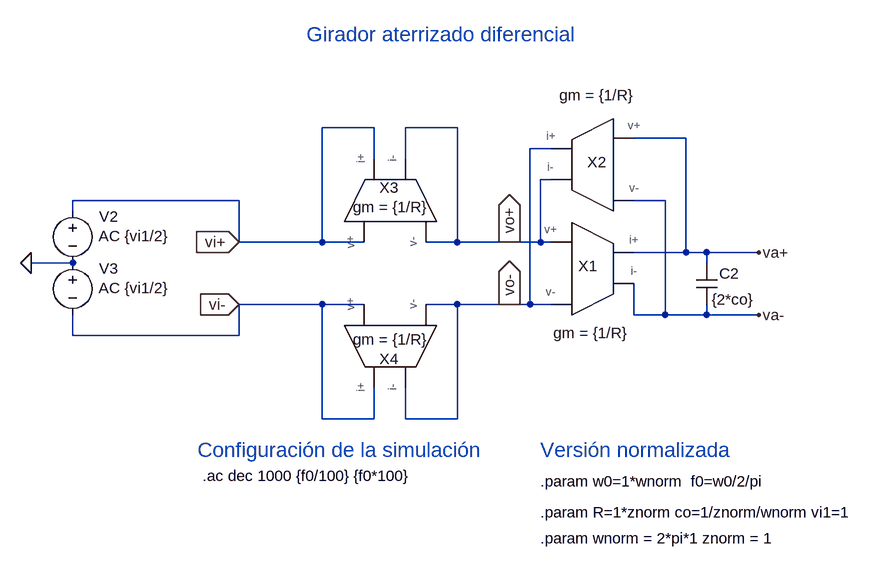
[diagram p0: schematic OTA girador aterrizado diferencial.asc]
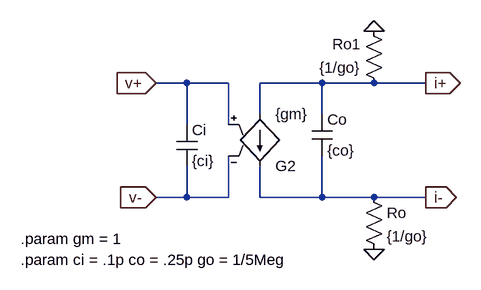
[diagram p1: sub-circuit ota_diff.asc]
OTA girador aterrizado diferencial.asc, the LTspice schematic file:
Version 4
SHEET 1 1244 880
WIRE 272 -96 192 -96
WIRE 400 -96 320 -96
WIRE 752 -80 672 -80
WIRE 544 -64 512 -64
WIRE 272 -48 272 -96
WIRE 320 -48 320 -96
WIRE 544 -16 528 -16
WIRE 64 16 -192 16
WIRE 720 16 672 16
WIRE -192 32 -192 16
WIRE 64 80 64 16
WIRE 192 80 192 -96
WIRE 192 80 64 80
WIRE 256 80 192 80
WIRE 400 80 400 -96
WIRE 400 80 352 80
WIRE 480 80 400 80
WIRE 528 80 528 -16
WIRE 528 80 480 80
WIRE 544 80 528 80
WIRE 752 96 752 -80
WIRE 752 96 672 96
WIRE 784 96 752 96
WIRE 864 96 784 96
WIRE -192 112 -256 112
WIRE 784 112 784 96
WIRE 192 176 64 176
WIRE 256 176 192 176
WIRE 400 176 352 176
WIRE 480 176 400 176
WIRE 512 176 512 -64
WIRE 512 176 480 176
WIRE 544 176 512 176
WIRE 672 192 672 144
WIRE 720 192 720 16
WIRE 720 192 672 192
WIRE 784 192 784 176
WIRE 784 192 720 192
WIRE 864 192 784 192
WIRE -192 224 -192 192
WIRE 64 224 64 176
WIRE 64 224 -192 224
WIRE 192 352 192 176
WIRE 272 352 272 304
WIRE 272 352 192 352
WIRE 320 352 320 304
WIRE 400 352 400 176
WIRE 400 352 320 352
FLAG 64 80 vi+
IOPIN 64 80 In
FLAG 480 80 vo+
IOPIN 480 80 Out
FLAG 64 176 vi-
IOPIN 64 176 In
FLAG -256 112 0
FLAG 480 176 vo-
IOPIN 480 176 Out
FLAG 864 96 va+
FLAG 864 192 va-
SYMBOL voltage -192 16 R0
WINDOW 123 40 55 Left 2
WINDOW 39 0 0 Left 0
WINDOW 0 41 25 Left 2
SYMATTR Value2 AC {vi1/2}
SYMATTR InstName V2
SYMATTR Value ""
SYMBOL voltage -192 96 R0
WINDOW 123 40 55 Left 2
WINDOW 39 0 0 Left 0
WINDOW 0 41 25 Left 2
SYMATTR Value2 AC {vi1/2}
SYMATTR InstName V3
SYMATTR Value ""
SYMBOL OTA_diff 624 128 R0
WINDOW 0 -23 -27 Top 2
WINDOW 39 -18 76 Top 2
SYMATTR InstName X1
SYMATTR SpiceLine gm = {1/R}
SYMBOL OTA_diff 592 -32 M0
WINDOW 0 -23 -27 Top 2
WINDOW 39 -23 -130 Top 2
SYMATTR InstName X2
SYMATTR SpiceLine gm = {1/R}
SYMBOL cap 768 112 R0
WINDOW 0 35 16 Left 2
SYMATTR InstName C2
SYMATTR Value {2*co}
SYMBOL OTA_diff 304 0 R270
WINDOW 0 -12 -9 VTop 2
WINDOW 39 -42 -7 VTop 2
SYMATTR InstName X3
SYMATTR SpiceLine gm = {1/R}
SYMBOL OTA_diff 304 256 M90
WINDOW 0 -12 -9 VTop 2
WINDOW 39 -42 -7 VTop 2
SYMATTR InstName X4
SYMATTR SpiceLine gm = {1/R}
TEXT 8 440 Left 2 !.ac dec 1000 {f0/100} {f0*100}
TEXT 0 400 Left 3 ;Configuración de la simulación
TEXT 528 400 Left 3 ;Versión normalizada
TEXT 528 448 Left 2 !.param w0=1*wnorm  f0=w0/2/pi
TEXT 168 -240 Left 3 ;Girador aterrizado diferencial
TEXT 528 496 Left 2 !.param R=1*znorm co=1/znorm/wnorm vi1=1
TEXT 528 536 Left 2 !.param wnorm = 2*pi*1 znorm = 1

ota_diff.asc, the sub-circuit schematic file:
Version 4
SHEET 1 880 680
WIRE -16 80 -64 80
WIRE 48 80 -16 80
WIRE 192 80 96 80
WIRE 272 80 192 80
WIRE 352 80 272 80
WIRE 96 128 96 80
WIRE 192 128 192 80
WIRE -16 144 -16 80
WIRE 48 144 48 80
WIRE -16 256 -16 208
WIRE -16 256 -64 256
WIRE 48 256 48 192
WIRE 48 256 -16 256
WIRE 96 256 96 208
WIRE 192 256 192 192
WIRE 192 256 96 256
WIRE 272 256 192 256
WIRE 352 256 272 256
FLAG 352 80 i+
IOPIN 352 80 Out
FLAG 352 256 i-
IOPIN 352 256 Out
FLAG -64 80 v+
IOPIN -64 80 In
FLAG -64 256 v-
IOPIN -64 256 In
FLAG 272 336 0
FLAG 272 0 0
SYMBOL cap -32 144 R0
SYMATTR InstName Ci
SYMATTR Value {ci}
SYMBOL cap 176 128 R0
SYMATTR InstName Co
SYMATTR Value {co}
SYMBOL res 256 240 R0
SYMATTR InstName Ro
SYMATTR Value {1/go}
SYMBOL g2 96 224 M180
SYMATTR InstName G2
SYMATTR Value {gm}
SYMBOL res 288 96 R180
WINDOW 0 36 76 Left 2
WINDOW 3 36 40 Left 2
SYMATTR InstName Ro1
SYMATTR Value {1/go}
TEXT -272 320 Left 2 !.param gm = 1
TEXT -272 352 Left 2 !.param ci = .1p co = .25p go = 1/5Meg

The netlist it stands for:
* OTA girador aterrizado diferencial.asc
V2 vi+ 0 AC {vi1/2}
V3 0 vi- AC {vi1/2}
XX1 va- va+ vo+ vo- ota_diff params: gm = {1/R}
XX2 vo+ vo- va+ va- ota_diff params: gm = {1/R}
C2 va+ va- {2*co}
XX3 vo+ vi+ vi+ vo+ ota_diff params: gm = {1/R}
XX4 vo- vi- vi- vo- ota_diff params: gm = {1/R}

* block symbol definitions
.subckt ota_diff i- i+ v+ v-
Ci v+ v- {ci}
Co i+ i- {co}
Ro i- 0 {1/go}
G2 i+ i- v+ v- {gm}
Ro1 i+ 0 {1/go}
.param gm = 1
.param ci = .1p co = .25p go = 1/5Meg
.ends ota_diff

.ac dec 1000 {f0/100} {f0*100}
* Configuración de la simulación
* Versión normalizada
.param w0=1*wnorm  f0=w0/2/pi
* Girador aterrizado diferencial
.param R=1*znorm co=1/znorm/wnorm vi1=1
.param wnorm = 2*pi*1 znorm = 1
.backanno
.end